# EAGLE design V2 (EAGLE 6.4)
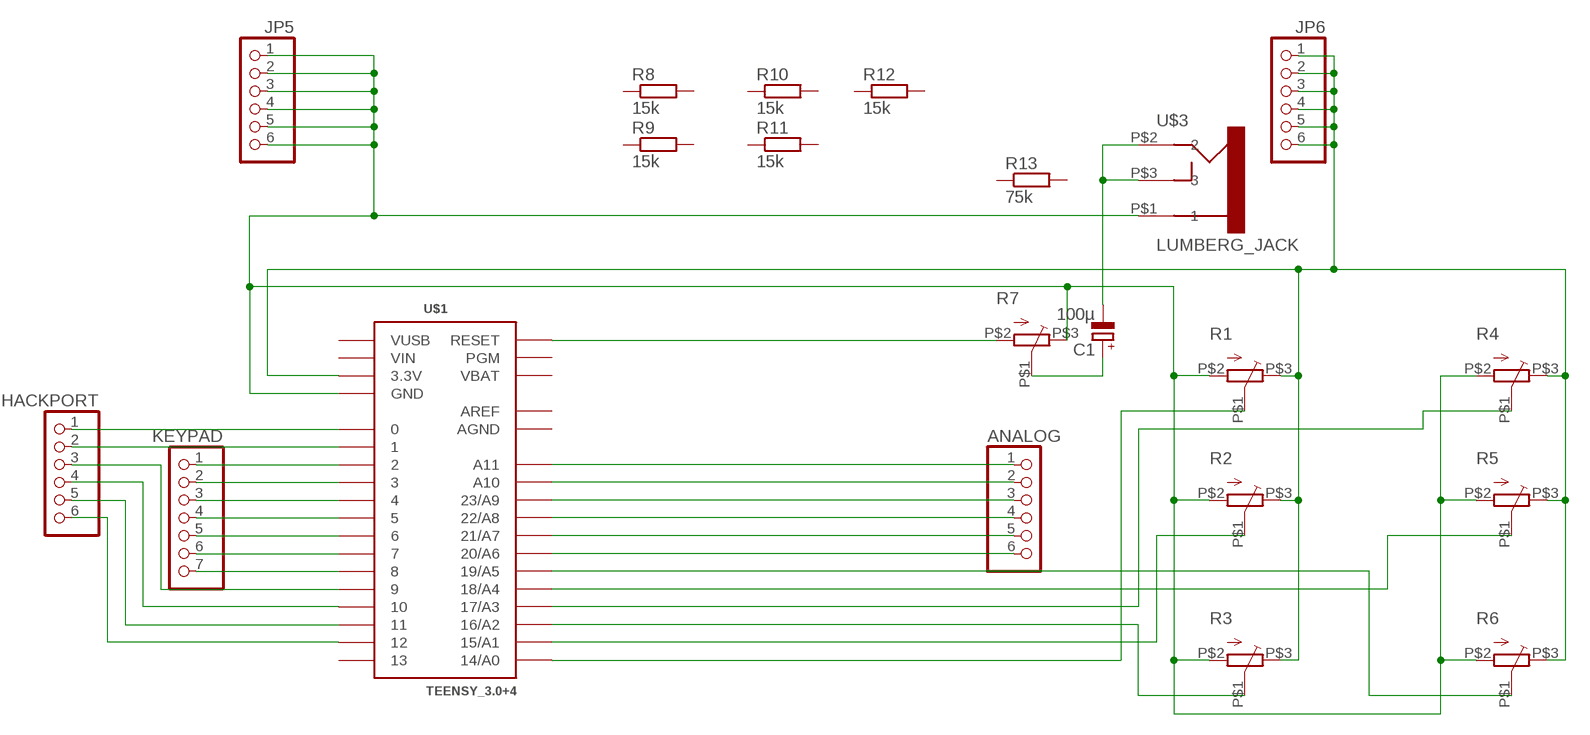
[diagram p0: schematic, sheet 1]

## Parts
ANALOG  PINHD-1X6  [1X06]
C1  100µ  CPOL-EUE2.5-6  [E2,5-6]
HACKPORT  PINHD-1X6  [1X06]
JP5  PINHD-1X6  [1X06]
JP6  PINHD-1X6  [1X06]
KEYPAD  PINHD-1X7  [1X07]
R1  STR09K113  [STR09K113]
R2  STR09K113  [STR09K113]
R3  STR09K113  [STR09K113]
R4  STR09K113  [STR09K113]
R5  STR09K113  [STR09K113]
R6  STR09K113  [STR09K113]
R7  STR09K113  [STR09K113]
R8  15k  R-EU_0309/12  [0309/12]
R9  15k  R-EU_0309/12  [0309/12]
R10  15k  R-EU_0309/12  [0309/12]
R11  15k  R-EU_0309/12  [0309/12]
R12  15k  R-EU_0309/12  [0309/12]
R13  75k  R-EU_0309/12  [0309/12]
U$1  TEENSY_3.0+4  [TEENSY_3.0+4]
U$3  LUMBERG_JACK  [JACK_CON]

## Nets
GND: JP5.1 JP5.2 JP5.3 JP5.4 JP5.5 JP5.6 R1.P$2(S) R2.P$2(S) R3.P$2(S) R4.P$2(S) R5.P$2(S) R6.P$2(S) R7.P$3(E) U$1.GND U$1.GND1(GND) U$3.P$1
N$1: R1.P$1(W) U$1.14/A0
N$2: R2.P$1(W) U$1.15/A1
N$3: R3.P$1(W) U$1.16/A2
N$4: R4.P$1(W) U$1.17/A3
N$5: R5.P$1(W) U$1.18/A4
N$6: R6.P$1(W) U$1.19/A5
N$7: KEYPAD.1 U$1.2
N$8: JP6.1 JP6.2 JP6.3 JP6.4 JP6.5 JP6.6 R1.P$3(E) R2.P$3(E) R3.P$3(E) R4.P$3(E) R5.P$3(E) R6.P$3(E) U$1.3.3V U$1.3.3V1(3.3V)
N$9: C1.- U$3.P$2 U$3.P$3
N$10: KEYPAD.2 U$1.3
N$11: KEYPAD.3 U$1.4
N$12: KEYPAD.4 U$1.5
N$13: KEYPAD.5 U$1.6
N$14: KEYPAD.6 U$1.7
N$15: KEYPAD.7 U$1.8
N$16: ANALOG.1 U$1.A11
N$17: ANALOG.2 U$1.A10
N$18: ANALOG.3 U$1.23/A9
N$19: ANALOG.4 U$1.22/A8
N$20: HACKPORT.1 U$1.0
N$21: HACKPORT.2 U$1.1
N$22: HACKPORT.3 U$1.9
N$23: HACKPORT.4 U$1.10
N$24: HACKPORT.5 U$1.11
N$25: HACKPORT.6 U$1.12
N$26: R7.P$2(S) U$1.RESET
N$27: C1.+ R7.P$1(W)
N$28: ANALOG.5 U$1.21/A7
N$29: ANALOG.6 U$1.20/A6
Unconnected: R8.1 R8.2 R9.1 R9.2 R10.1 R10.2 R11.1 R11.2 R12.1 R12.2 R13.1 R13.2 U$1.13 U$1.PGM

## Power pins joined to a net without a drawn wire
AGND: U$1.AGND
AREF: U$1.AREF
VBAT: U$1.VBAT
VIN: U$1.VIN
VUSB: U$1.VUSB

## Library data of the parts
ANALOG HACKPORT JP5 JP6 = pinhead:PINHD-1X6: PIN HEADER
C1 = rcl:CPOL-EU: POLARIZED CAPACITOR, European symbol
KEYPAD = pinhead:PINHD-1X7: PIN HEADER
R1-R7 = anyma-lib:STR09K113: Alps Potentiometer
R8-R13 = resistor:R-EU_: RESISTOR, European symbol
U$1 = Teensy3.0:TEENSY_3.0+4: Teensy 3.0 board, showing all pins that are easily acessible. See 'AllAnalogPins" and 'AllPins' packages for additional pin holes, as needed. The 'Basic' package has fewer pins.
U$3 = eigene:LUMBERG_JACK: 3.5 mm Jack connector 1502 03

## Board
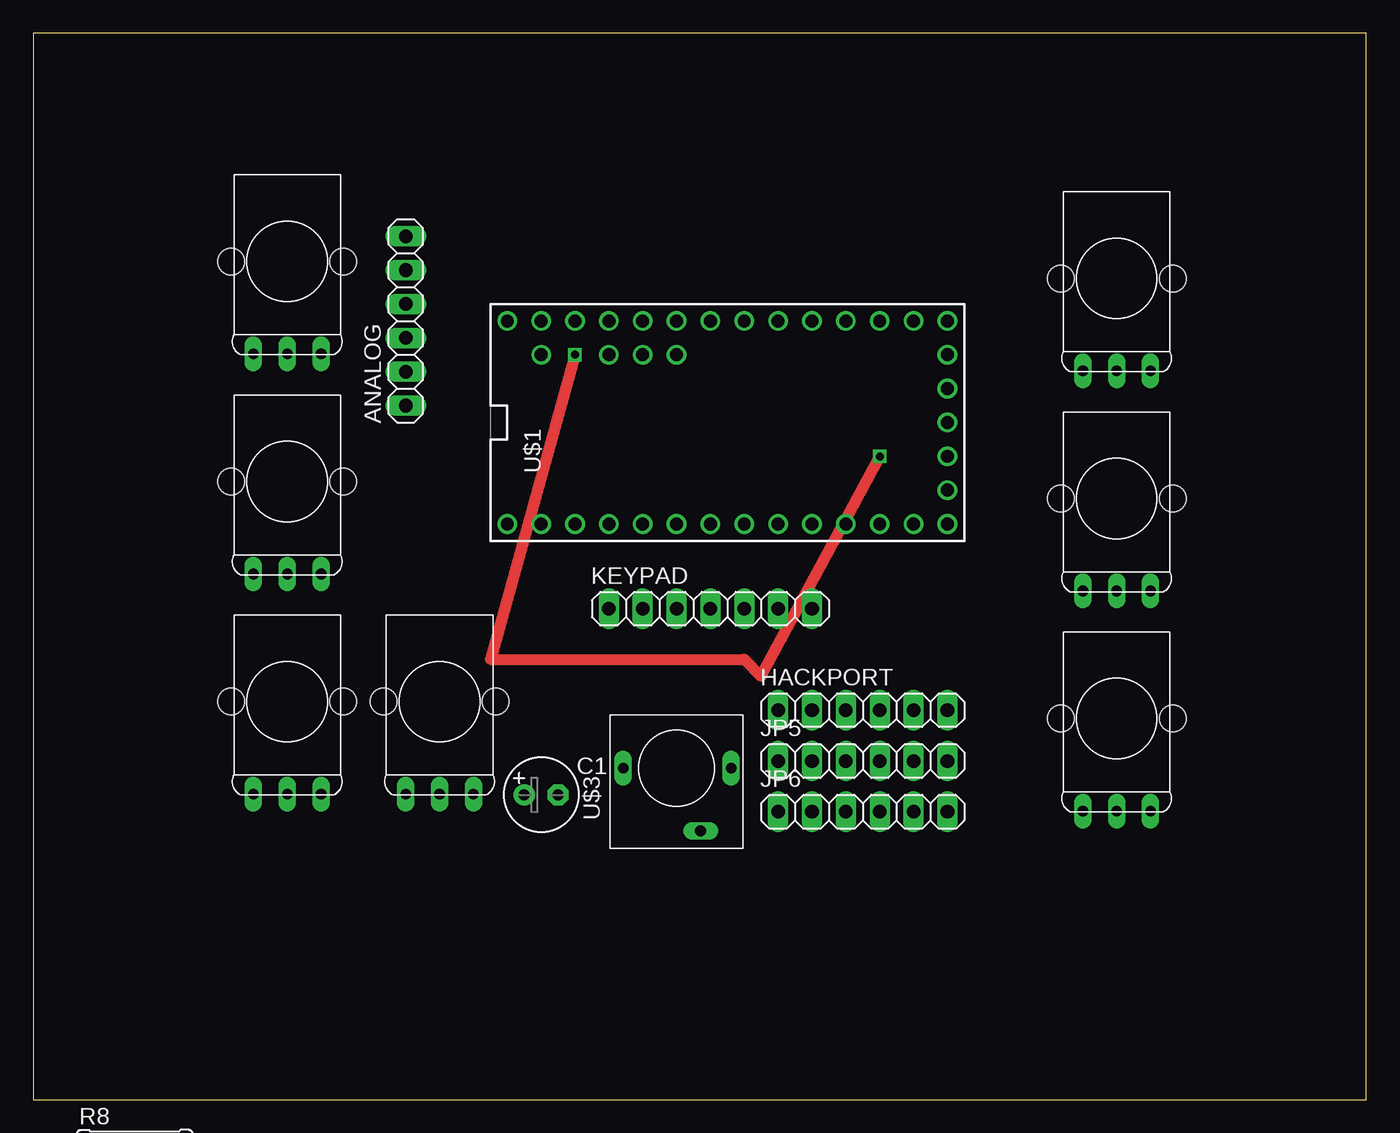
[diagram p1: board, top side]
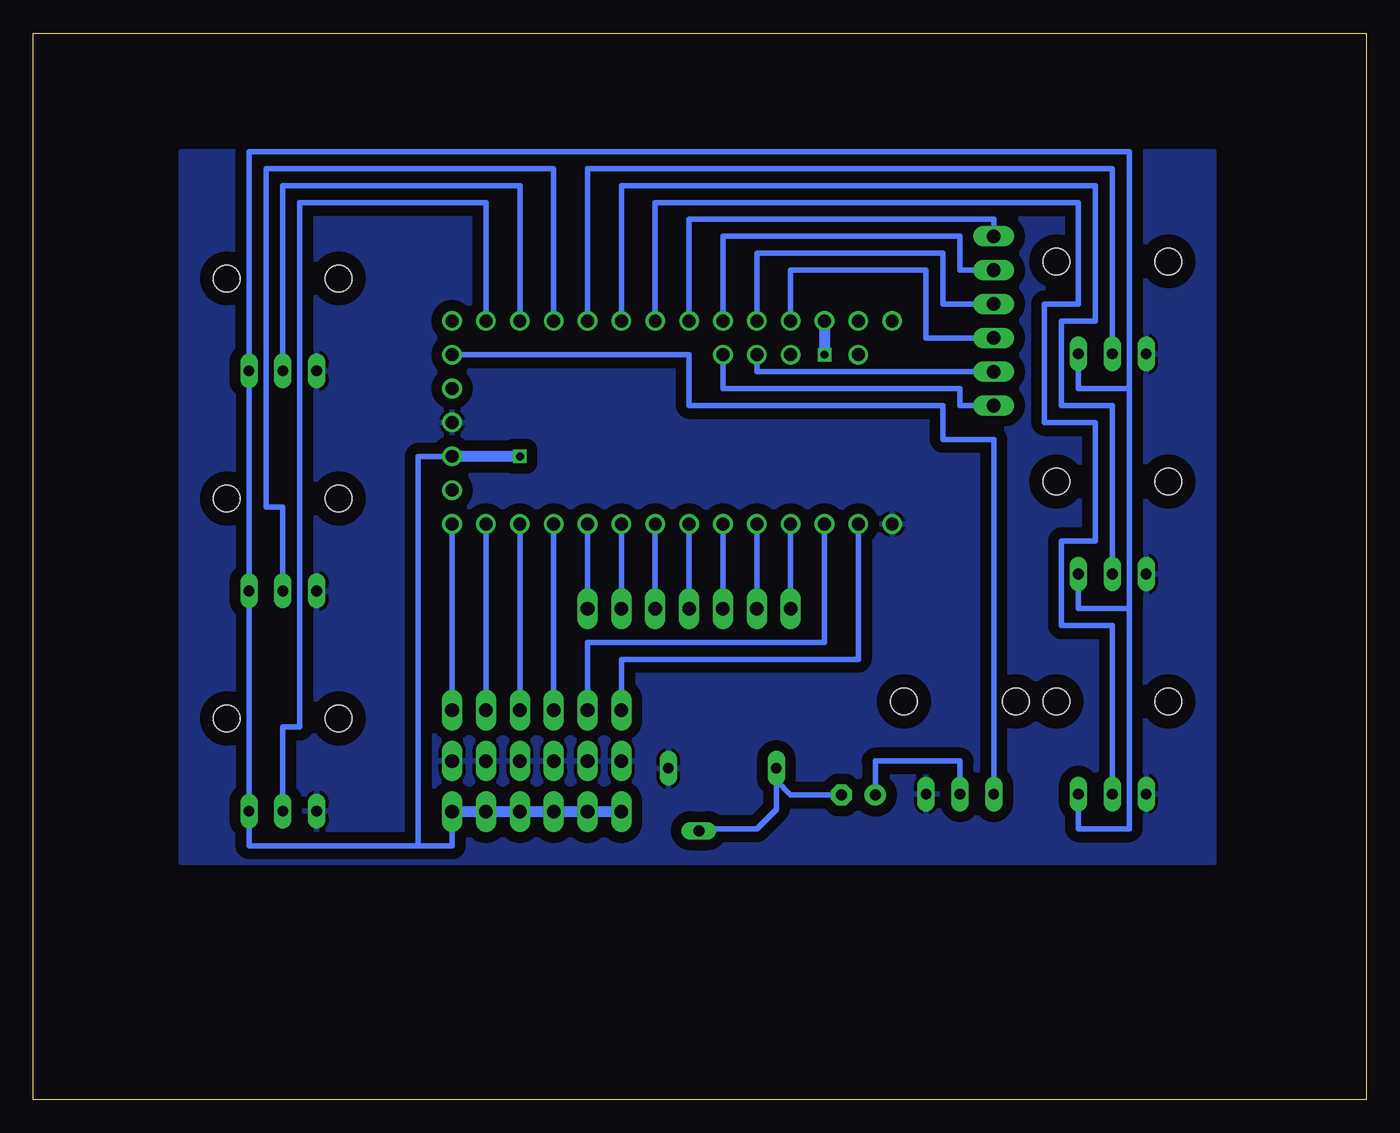
[diagram p2: board, bottom side, seen from below]

Size 100 x 80 mm. Coordinates in mm from the lower left corner, seen from the top.
Outline: 0,0 100,0 100,80 0,80 0,0
Copper layers (1*16): Top 0.035mm / dielectric 1.5mm / Bottom 0.035mm
Design rules "default *": minimum track width 10mil, minimum drill 24mil, track to track 32mil, track to pad 32mil, pad to pad 32mil, via to via 32mil, smd to smd 32mil, copper to edge 40mil, drill to drill 8mil, minimum pad ring 10mil, minimum via ring 8mil, stop-mask expansion 4mil, vias tented up to drill 0mil, thermal gap 10mil

### Footprints (pad centres in the part's own frame; a part is rotated, then mirrored left to right if it is on the bottom)
1X06 = drill 1.016 long: 1 -6.35,0; 2 -3.81,0; 3 -1.27,0; 4 1.27,0; 5 3.81,0; 6 6.35,0
E2,5-6 = drill 0.813 pad 1.6: + -1.27,0 | drill 0.813 pad 1.6 octagon: - 1.27,0
1X07 = drill 1.016 long: 1 -7.62,0; 2 -5.08,0; 3 -2.54,0; 4 0,0; 5 2.54,0; 6 5.08,0; 7 7.62,0
STR09K113 = drill 0.8 long: P$1 0,0.06; P$2 -2.54,0.06; P$3 2.54,0.06 | hole 2: -4.2,7; 4.2,7
0309/12 = drill 0.813 octagon: 1 -6.35,0; 2 6.35,0
TEENSY_3.0+4 = drill 0.965: 0 -7.62,13.97; 1 -7.62,11.43; 2 -7.62,8.89; 3 -7.62,6.35; 3.3V 7.62,11.43; 3.3V1 -2.54,-16.51; 4 -7.62,3.81; 5 -7.62,1.27; 6 -7.62,-1.27; 7 -7.62,-3.81; 8 -7.62,-6.35; 9 -7.62,-8.89; 10 -7.62,-11.43; 11 -7.62,-13.97; 12 -7.62,-16.51; 13 7.62,-16.51; 14/A0 7.62,-13.97; 15/A1 7.62,-11.43; 16/A2 7.62,-8.89; 17/A3 7.62,-6.35; 18/A4 7.62,-3.81; 19/A5 7.62,-1.27; 20/A6 7.62,1.27; 21/A7 7.62,3.81; 22/A8 7.62,6.35; 23/A9 7.62,8.89; A10 5.08,6.35; A11 5.08,3.81; AGND 7.62,13.97; AREF 5.08,8.89; GND -7.62,16.51; GND1 0,-16.51; PGM 2.54,-16.51; RESET 5.08,-16.51; VBAT -5.08,-16.51; VIN 7.62,16.51; VUSB 5.08,13.97
JACK_CON = drill 0.8 long: P$1 2,-4.1; P$2 2,4; P$3 -2.7,-1.8

### Placement (x,y rotation side)
ANALOG  27.94,58.42 90 top
C1  38.1,22.86 0 top
HACKPORT  62.23,29.21 0 top
JP5  62.23,25.4 0 top
JP6  62.23,21.59 0 top
KEYPAD  50.8,36.83 0 top
R1  81.28,21.59 0 top
R2  81.28,54.61 0 top
R3  81.28,38.1 0 top
R4  19.05,55.88 0 top
R5  19.05,39.37 0 top
R6  19.05,22.86 0 top
R7  30.48,22.86 0 top
R8  7.62,-3.81 0 top  (outside the outline)
R9  7.62,-10.16 0 top  (outside the outline)
R10  7.62,-16.51 0 top  (outside the outline)
R11  7.62,-22.86 0 top  (outside the outline)
R12  7.62,-29.21 0 top  (outside the outline)
R13  7.62,-35.56 0 top  (outside the outline)
U$1  52.07,50.8 90 top
U$3  48.26,22.86 90 top

### Tracks (layer width: path | path; a pad name or v marks a point on that pad's centre or on a via)
GND
  pour Bottom: 11.43,71.12 88.9,71.12 88.9,17.78 11.43,17.78
N$1
  Bottom 0.406: U$1.14/A0 66.04,67.31 80.01,67.31 80.01,27.94 81.28,27.94 R1.P$1
N$2
  Bottom 0.406: U$1.15/A1 63.5,68.58 81.28,68.58 R2.P$1
N$3
  Bottom 0.406: U$1.16/A2 60.96,69.85 82.55,69.85 82.55,44.45 81.28,44.45 R3.P$1
N$4
  Bottom 0.406: R4.P$1 19.05,69.85 58.42,69.85 U$1.17/A3
N$5
  Bottom 0.406: U$1.18/A4 55.88,68.58 20.32,68.58 20.32,58.42 22.86,58.42 22.86,52.07 19.05,52.07 R5.P$1 19.05,39.37
N$6
  Bottom 0.406: U$1.19/A5 53.34,67.31 21.59,67.31 21.59,59.69 24.13,59.69 24.13,50.8 20.32,50.8 20.32,41.91 22.86,41.91 22.86,35.56 19.05,35.56 R6.P$1
N$7
  Bottom 0.406: U$1.2 KEYPAD.1
N$8  (via drill 0.6)
  Top 0.813: v40.64,55.88 34.29,33.02 53.34,33.02 54.61,31.75 v63.5,48.26
  Bottom 0.406: R4.P$3 21.59,53.34 17.78,53.34 | 17.78,53.34 17.78,36.83 | 17.78,36.83 21.59,36.83 R5.P$3 | R6.P$3 21.59,20.32 17.78,20.32 17.78,36.83 | 17.78,53.34 17.78,71.12 83.82,71.12 R2.P$3 R3.P$3 | JP6.6 68.58,19.05 71.12,19.05 | 71.12,19.05 83.82,19.05 R1.P$3 R3.P$3 | U$1.3.3V1 71.12,48.26 71.12,19.05 | R3.P$3 83.82,36.83
  Bottom 0.813: JP6.1 JP6.2 JP6.3 JP6.4 JP6.5 JP6.6 | U$1.3.3V v40.64,55.88 | v63.5,48.26 U$1.3.3V1
N$9
  Bottom 0.406: U$3.P$3 49.9,20.32 45.72,20.32 44.26,21.78 U$3.P$2 44.26,23.94 43.18,22.86 C1.-
N$10
  Bottom 0.406: U$1.3 KEYPAD.2
N$11
  Bottom 0.406: KEYPAD.3 U$1.4
N$12
  Bottom 0.406: U$1.5 KEYPAD.4
N$13
  Bottom 0.406: U$1.6 KEYPAD.5
N$14
  Bottom 0.406: U$1.7 KEYPAD.6
N$15
  Bottom 0.406: U$1.8 KEYPAD.7
N$16
  Bottom 0.406: U$1.A11 48.26,53.34 30.48,53.34 30.48,52.07 ANALOG.1
N$17
  Bottom 0.406: ANALOG.2 45.72,54.61 U$1.A10
N$18
  Bottom 0.406: ANALOG.3 33.02,57.15 33.02,62.23 43.18,62.23 U$1.23/A9
N$19
  Bottom 0.406: ANALOG.4 31.75,59.69 31.75,63.5 45.72,63.5 U$1.22/A8
N$20
  Bottom 0.406: U$1.0 38.1,33.02 55.88,33.02 HACKPORT.1
N$21
  Bottom 0.406: HACKPORT.2 58.42,34.29 40.64,34.29 U$1.1
N$22
  Bottom 0.406: U$1.9 HACKPORT.3
N$23
  Bottom 0.406: U$1.10 HACKPORT.4
N$24
  Bottom 0.406: U$1.11 HACKPORT.5
N$25
  Bottom 0.406: U$1.12 HACKPORT.6
N$26
  Bottom 0.406: U$1.RESET 50.8,55.88 50.8,52.07 31.75,52.07 31.75,49.53 27.94,49.53 R7.P$2
N$27
  Bottom 0.406: R7.P$1 30.48,25.4 36.83,25.4 C1.+
N$28
  Bottom 0.406: ANALOG.5 30.48,62.23 30.48,64.77 48.26,64.77 U$1.21/A7
N$29
  Bottom 0.406: U$1.20/A6 50.8,66.04 27.94,66.04 ANALOG.6